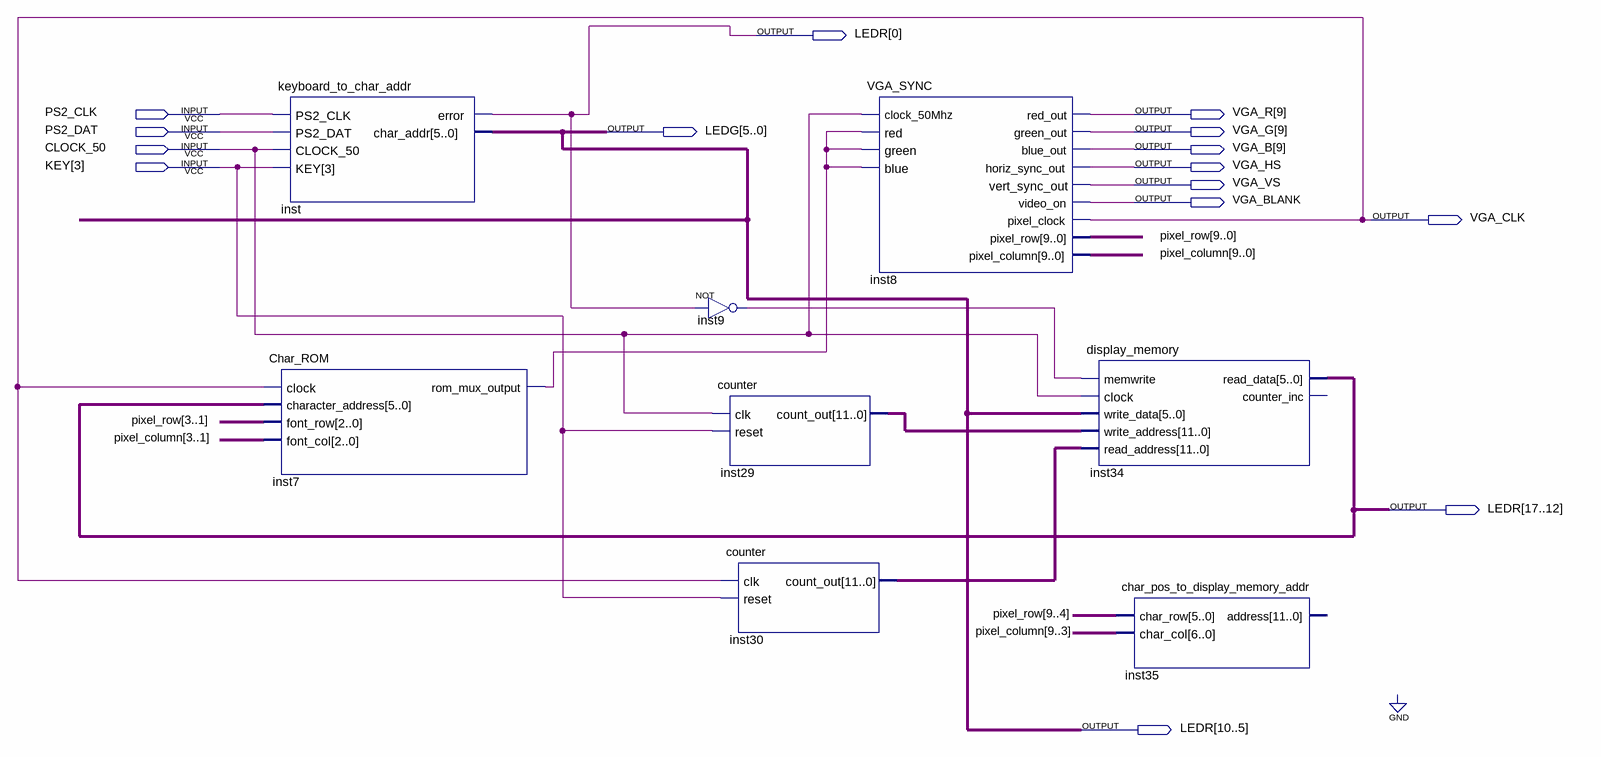
[diagram p0: schematic sheet]
// Quartus schematic temp2.bdf as structural Verilog: 8 symbols, 15 pins
module temp2 (
  input  PS2_CLK,
  input  PS2_DAT,
  input  CLOCK_50,
  input  [3:3] KEY,
  output [17:0] LEDR,
  output [9:9] VGA_R,
  output [5:0] LEDG,
  output [9:9] VGA_G,
  output [9:9] VGA_B,
  output VGA_HS,
  output VGA_VS,
  output VGA_BLANK,
  output VGA_CLK
);

  wire inst7_rom_mux_output, inst9_out;
  wire [9:0] pixel_column, pixel_row;
  wire [11:0] inst29_count_out, inst30_count_out;

  Char_ROM inst7 (
    .clock(VGA_CLK), .character_address(LEDR[17:12]), .font_row(pixel_row[3:1]),
    .font_col(pixel_column[3:1]), .rom_mux_output(inst7_rom_mux_output));
  keyboard_to_char_addr inst (
    .PS2_CLK(PS2_CLK), .PS2_DAT(PS2_DAT), .CLOCK_50(CLOCK_50), .KEY(KEY[3]), .error(LEDR[0]), .char_addr(LEDG));
  not inst9 (inst9_out, LEDR[0]);
  counter inst29 (.clk(CLOCK_50), .reset(KEY[3]), .count_out(inst29_count_out));
  counter inst30 (.clk(VGA_CLK), .reset(KEY[3]), .count_out(inst30_count_out));
  VGA_SYNC inst8 (
    .clock_50Mhz(CLOCK_50), .red(inst7_rom_mux_output), .green(inst7_rom_mux_output),
    .blue(inst7_rom_mux_output), .red_out(VGA_R[9]), .green_out(VGA_G[9]), .blue_out(VGA_B[9]),
    .horiz_sync_out(VGA_HS), .vert_sync_out(VGA_VS), .video_on(VGA_BLANK), .pixel_clock(VGA_CLK),
    .pixel_row(pixel_row), .pixel_column(pixel_column));
  display_memory inst34 (
    .memwrite(inst9_out), .clock(CLOCK_50), .write_data(LEDG), .write_address(inst29_count_out),
    .read_address(inst30_count_out), .read_data(LEDR[17:12]));  // open: counter_inc
  char_pos_to_display_memory_addr inst35 (.char_row(pixel_row[9:4]), .char_col(pixel_column[9:3]));  // open: address

  assign LEDR[10:5] = LEDG;
endmodule
